# Altium schematic sheet MCU Sup.SchDoc
size 297 x 209 mm; SheetNumber: 21; SheetTotal: 29
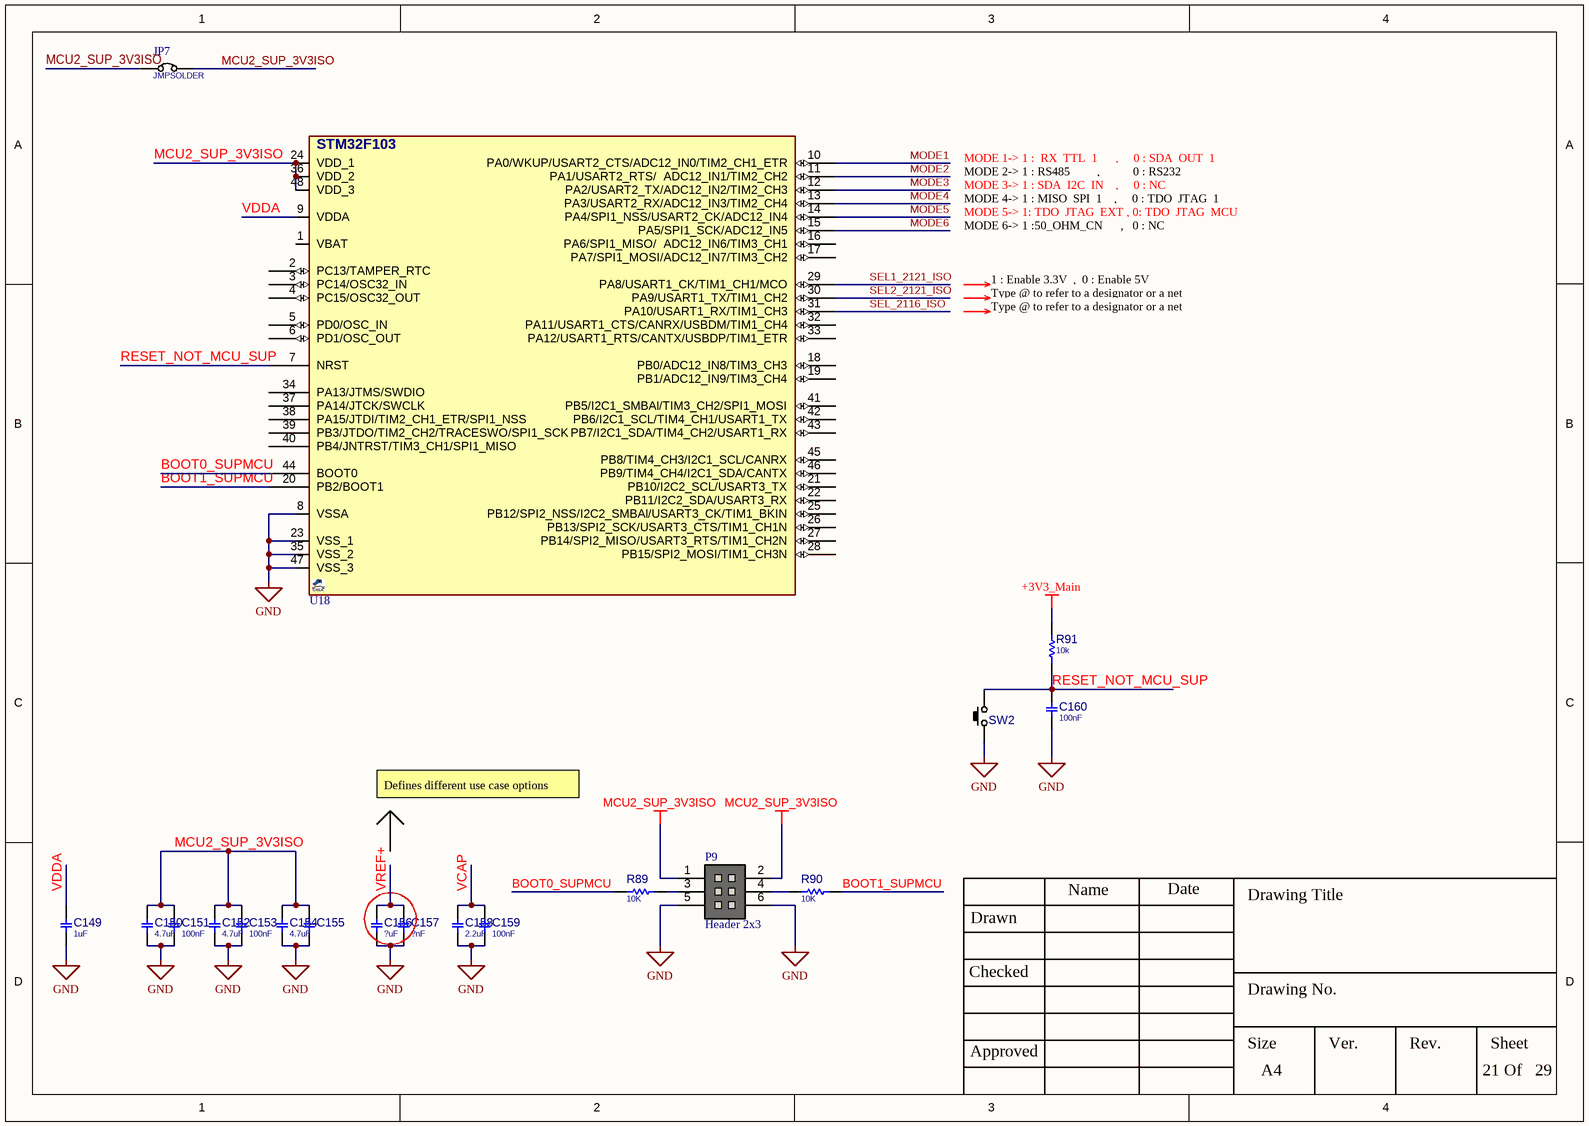
[diagram p0: MCU Sup.SchDoc]

## Parts
C149  1uF  [C0805]
C150  4.7uF  [C0805]
C151  100nF  [C0603]
C152  4.7uF  [C0805]
C153  100nF  [C0603]
C154  4.7uF  [C0805]
C155  (no value)  [C0603]
C156  ?uF  [C0805]
C157  ?nF  [C0603]
C158  2.2uF  [C0805]
C159  100nF  [C0603]
C160  100nF  [C0603]
JP7  JMPSOLDER  [JP_40X50]
P9  Header 2x3  [HDR 2X3]
R89  10K  [R0603]
R90  10K  [R0603]
R91  10k  [R0603]
SW2  PUSHBUTTON  [SWPBS_SPST_6X3X5]  (value not drawn)
U18  STM32F103  [QFG50_48]  (value not drawn)

## Nets
+3V3_Main: R91.2
GND: C149.2 C150.2 C151.2 C152.2 C153.2 C154.2 C155.2 C156.2 C157.2 C158.2 C159.2 C160.2 P9.5 P9.6 SW2.1(P1) U18.8(VSSA) U18.23(VSS_1) U18.35(VSS_2) U18.47(VSS_3)
MCU2_SUP_3V3ISO: C150.1 C151.1 C152.1 C153.1 C154.1 C155.1 JP7.1 JP7.2 P9.1 P9.2 U18.24(VDD_1) U18.36(VDD_2) U18.48(VDD_3)
BOOT0_SUPMCU: R89.1 U18.44(BOOT0)
BOOT1_SUPMCU: R90.2 U18.20(PB2/BOOT1)
MODE1: U18.10(PA0/WKUP/USART2_CTS/ADC12_IN0/TIM2_CH1_ETR)
MODE2: U18.11(PA1/USART2_RTS/__ADC12_IN1/TIM2_CH2)
MODE3: U18.12(PA2/USART2_TX/ADC12_IN2/TIM2_CH3)
MODE4: U18.13(PA3/USART2_RX/ADC12_IN3/TIM2_CH4)
MODE5: U18.14(PA4/SPI1_NSS/USART2_CK/ADC12_IN4)
MODE6: U18.15(PA5/SPI1_SCK/ADC12_IN5)
RESET_NOT_MCU_SUP: C160.1 R91.1 SW2.2(P3) U18.7(NRST)
SEL1_2121_ISO: U18.29(PA8/USART1_CK/TIM1_CH1/MCO)
SEL2_2121_ISO: U18.30(PA9/USART1_TX/TIM1_CH2)
SEL_2116_ISO: U18.31(PA10/USART1_RX/TIM1_CH3)
VCAP: C158.1 C159.1
VDDA: C149.1 U18.9(VDDA)
VREF+: C156.1 C157.1
NetP9_3: P9.3 R89.2
NetP9_4: P9.4 R90.1

Not connected (* = marked no-connect by the designer): U18 1(VBAT) 2(PC13/TAMPER_RTC) 3(PC14/OSC32_IN) 4(PC15/OSC32_OUT) 5(PD0/OSC_IN) 6(PD1/OSC_OUT) 16(PA6/SPI1_MISO/__ADC12_IN6/TIM3_CH1) 17(PA7/SPI1_MOSI/ADC12_IN7/TIM3_CH2) 18(PB0/ADC12_IN8/TIM3_CH3) 19(PB1/ADC12_IN9/TIM3_CH4) 21(PB10/I2C2_SCL/USART3_TX) 22(PB11/I2C2_SDA/USART3_RX) 25(PB12/SPI2_NSS/I2C2_SMBAl/USART3_CK/TIM1_BKIN) 26(PB13/SPI2_SCK/USART3_CTS/TIM1_CH1N) 27(PB14/SPI2_MISO/USART3_RTS/TIM1_CH2N) 28(PB15/SPI2_MOSI/TIM1_CH3N) 32(PA11/USART1_CTS/CANRX/USBDM/TIM1_CH4) 33(PA12/USART1_RTS/CANTX/USBDP/TIM1_ETR) 34(PA13/JTMS/SWDIO) 37(PA14/JTCK/SWCLK) 38(PA15/JTDI/TIM2_CH1_ETR/SPI1_NSS) 39(PB3/JTDO/TIM2_CH2/TRACESWO/SPI1_SCK) 40(PB4/JNTRST/TIM3_CH1/SPI1_MISO) 41(PB5/I2C1_SMBAl/TIM3_CH2/SPI1_MOSI) 42(PB6/I2C1_SCL/TIM4_CH1/USART1_TX) 43(PB7/I2C1_SDA/TIM4_CH2/USART1_RX) 45(PB8/TIM4_CH3/I2C1_SCL/CANRX) 46(PB9/TIM4_CH4/I2C1_SDA/CANTX)

## Notes on the sheet
- MODE 1-> 1 :  RX_TTL_1      ,     0 : SDA_OUT_1
- MODE 2-> 1 : RS485         ,           0 : RS232
- MODE 3-> 1 : SDA_I2C_IN    ,     0 : NC
- MODE 4-> 1 : MISO_SPI_1    ,     0 : TDO_JTAG_1
- MODE 5-> 1: TDO_JTAG_EXT , 0: TDO_JTAG_MCU
- MODE 6-> 1 :50_OHM_CN      ,   0 : NC
- 1 : Enable 3.3V  ,  0 : Enable 5V
- Type @ to refer to a designator or a net
- Defines different use case options
- Drawn
- Name
- Date
- Drawing Title
- Checked
- Drawing No.
- Approved
- Size
- A4
- Ver.
- Rev.
- Sheet
- Of

## Library data of the parts
C149 C150 C152 C154 C156 C158 = CAP_SMD_MLCC_2.2u50V_0805: CAP, MLCC; MANF_P#: UMK212ABJ225KG-T; MANF: Taiyo Yuden; PARAM: X5R, 10%; DIST#: MOUSER; PARAM2: 50V; ASSEMBLY: ASSEMBLY; PRICE: 100= 10$; DESC: CAP, MLCC
  C149: VALUE: 1uF
  C150 C152 C154: VALUE: 4.7uF
  C156: VALUE: ?uF
  C158: VALUE: 2.2uF
C151 C153 C155 C157 C159 C160 = CAP_SMD_MLCC_2.2u50V_0603: CAP, MLCC; MANF_P#: C1005X7R1H104K050BB; MANF: TDK; PARAM: X7R, 10%; DIST#: MOUSER; PARAM2: 50V; ASSEMBLY: ASSEMBLY; PRICE: 1000= 27$; DESC: CAP, MLCC
  C151 C153 C159 C160: VALUE: 100nF
  C157: VALUE: ?nF
JP7 = JUMPER_SOLDER: JUMPER, HEADER 2PIN; MANF: MANF; MANF_P#: MANF_P#; VALUE: JMPSOLDER
R89 R90 = RES_SMD: RESISTOR, SMD; PARAM: -W; DESC: DESCRIPTION; DIST#: MOUSER; PARAM2: 1%; MANF_P#: -; MANF: -; ASSEMBLY: ASSEMBLY; PRICE: 100= 0.5$; VALUE: 10K
R91 = RES_SMD_0603: RESISTOR, SMD; PARAM: -W; DESC: DESCRIPTION; DIST#: MOUSER; PARAM2: 1%; MANF_P#: -; MANF: -; ASSEMBLY: ASSEMBLY; PRICE: 100= 0.5$; VALUE: 10k
SW2 = SWPBS_SPST_6X3X5: SWITCH, PUSH BUTTON, TACTILE, SMD, SPST, 6X3.5X5mm; MANF: ALPS; DESC: DESCRIPTION; MANF_P#: SKQMBBE010; VALUE: PUSHBUTTON; ASSEMBLY: ASSEMBLY; PARAM: PARAM; PRICE: PRICE
U18 = STM32F103C8T6_QFP48: MCU, STM32 ARM 32-bit, Cortex M3, 64KB FLASH, 20KB SRAM; DESC: CAN, I2C, SPI, USART, USB; MANF: ST; PARAM2: 2~3.6VCC, 72MHz, 2X12Bit ADC; PARAM: 64KB FLASH, 20KB SRAM, -40~85oC; MANF_P#: STM32F103C8T6; PRICE: 6$; VALUE: STM32F103
P9 = Header 2x3: ComponentLinkp-URL: https://www.smartw.ir/; DatasheetVersion: 2020